# Altium schematic sheet Led.SchDoc
size A3
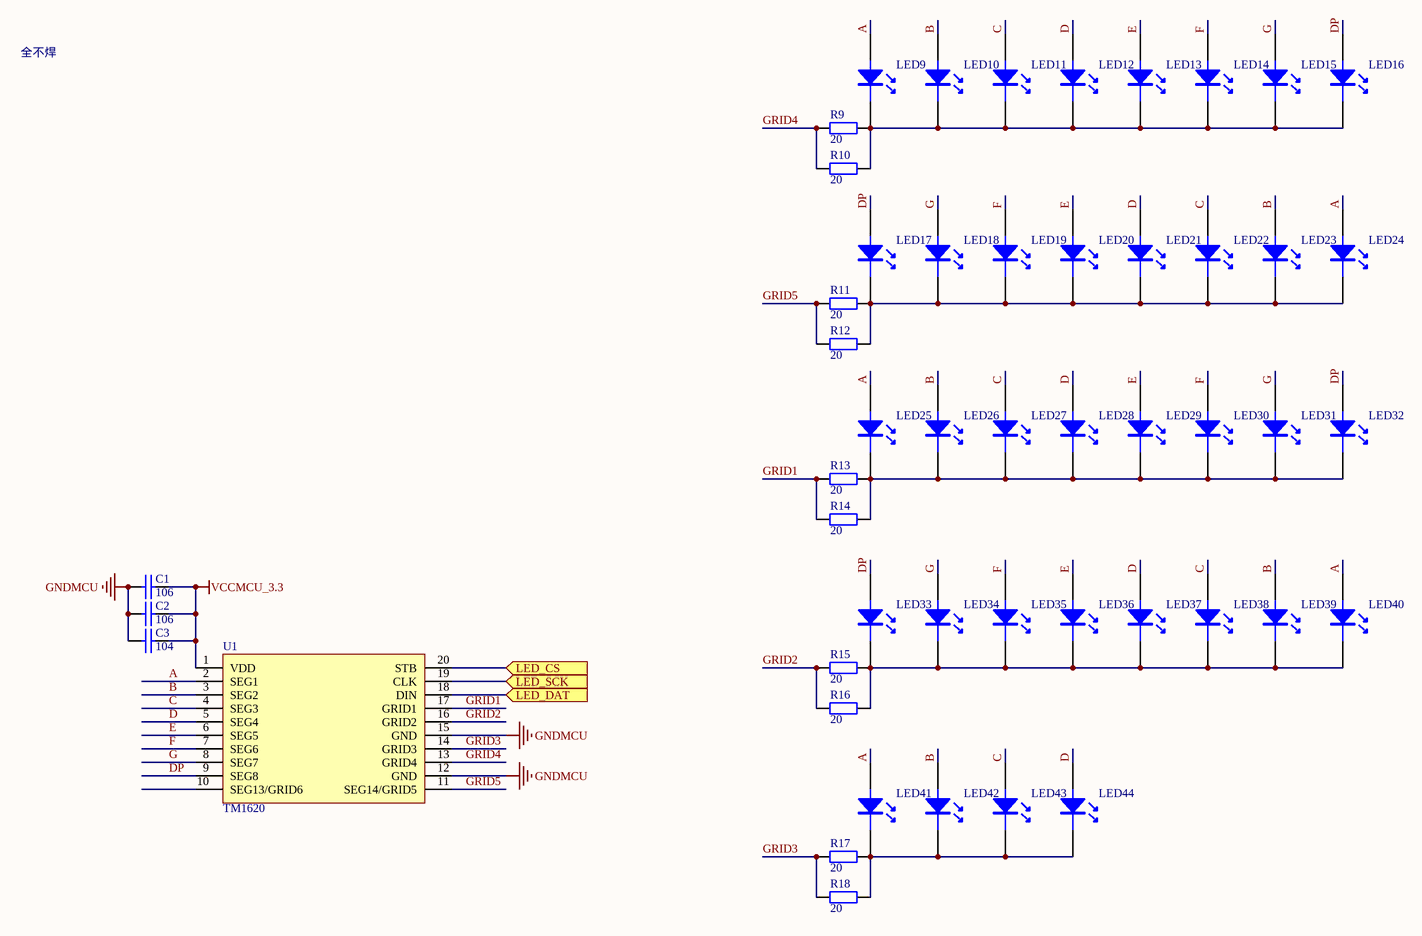
[diagram p0: Led.SchDoc]

## Parts
C1  106  [0805/C2]
C2  106  [0805/C2]
C3  104  [0805/C2]
LED9  (no value)  [LED0805]
LED10  (no value)  [LED0805]
LED11  (no value)  [LED0805]
LED12  (no value)  [LED0805]
LED13  (no value)  [LED0805]
LED14  (no value)  [LED0805]
LED15  (no value)  [LED0805]
LED16  (no value)  [LED0805]
LED17  (no value)  [LED0805]
LED18  (no value)  [LED0805]
LED19  (no value)  [LED0805]
LED20  (no value)  [LED0805]
LED21  (no value)  [LED0805]
LED22  (no value)  [LED0805]
LED23  (no value)  [LED0805]
LED24  (no value)  [LED0805]
LED25  (no value)  [LED0805]
LED26  (no value)  [LED0805]
LED27  (no value)  [LED0805]
LED28  (no value)  [LED0805]
LED29  (no value)  [LED0805]
LED30  (no value)  [LED0805]
LED31  (no value)  [LED0805]
LED32  (no value)  [LED0805]
LED33  (no value)  [LED0805]
LED34  (no value)  [LED0805]
LED35  (no value)  [LED0805]
LED36  (no value)  [LED0805]
LED37  (no value)  [LED0805]
LED38  (no value)  [LED0805]
LED39  (no value)  [LED0805]
LED40  (no value)  [LED0805]
LED41  (no value)  [LED0805]
LED42  (no value)  [LED0805]
LED43  (no value)  [LED0805]
LED44  (no value)  [LED0805]
R9  20  [0805/R2]
R10  20  [0805/R2]
R11  20  [0805/R2]
R12  20  [0805/R2]
R13  20  [0805/R2]
R14  20  [0805/R2]
R15  20  [0805/R2]
R16  20  [0805/R2]
R17  20  [0805/R2]
R18  20  [0805/R2]
U1  TM1620  [SOL-20]

## Ports
LED_CS (in), LED_DAT (in), LED_SCK (in)

## Nets
GNDMCU: C1.2 C2.2 C3.1 U1.12(GND) U1.15(GND)
VCCMCU_3.3: C1.1 C2.1 C3.2 U1.1(VDD)
A: LED9.1 LED24.1 LED25.1 LED40.1 LED41.1 U1.2(SEG1)
B: LED10.1 LED23.1 LED26.1 LED39.1 LED42.1 U1.3(SEG2)
C: LED11.1 LED22.1 LED27.1 LED38.1 LED43.1 U1.4(SEG3)
D: LED12.1 LED21.1 LED28.1 LED37.1 LED44.1 U1.5(SEG4)
DP: LED16.1 LED17.1 LED32.1 LED33.1 U1.9(SEG8)
E: LED13.1 LED20.1 LED29.1 LED36.1 U1.6(SEG5)
F: LED14.1 LED19.1 LED30.1 LED35.1 U1.7(SEG6)
G: LED15.1 LED18.1 LED31.1 LED34.1 U1.8(SEG7)
GRID1: R13.1 R14.1 U1.17(GRID1)
GRID2: R15.1 R16.1 U1.16(GRID2)
GRID3: R17.1 R18.1 U1.14(GRID3)
GRID4: R9.1 R10.1 U1.13(GRID4)
GRID5: R11.1 R12.1 U1.11(SEG14/GRID5)
LED_CS: U1.20(STB) ; port LED_CS
LED_DAT: U1.18(DIN) ; port LED_DAT
LED_SCK: U1.19(CLK) ; port LED_SCK
NetLED9_2: LED9.2 LED10.2 LED11.2 LED12.2 LED13.2 LED14.2 LED15.2 LED16.2 R9.2 R10.2
NetLED17_2: LED17.2 LED18.2 LED19.2 LED20.2 LED21.2 LED22.2 LED23.2 LED24.2 R11.2 R12.2
NetLED25_2: LED25.2 LED26.2 LED27.2 LED28.2 LED29.2 LED30.2 LED31.2 LED32.2 R13.2 R14.2
NetLED33_2: LED33.2 LED34.2 LED35.2 LED36.2 LED37.2 LED38.2 LED39.2 LED40.2 R15.2 R16.2
NetLED41_2: LED41.2 LED42.2 LED43.2 LED44.2 R17.2 R18.2

Not connected (* = marked no-connect by the designer): U1 10(SEG13/GRID6)

## Notes on the sheet
- 全不焊
- Title
- Size:
- Date:
- A3
- Number:
- Time:
- Revision:
- Sheet
- of
- File:

## Library data of the parts
C1-C3 = CAP: Capacitor
LED9-LED44 = LED-PH
R9-R18 = RES1
U1 = TM1620: 8 段×6 位～10段×4位 串行接口 共阴